# Altium project 17WAN.PrjPCB
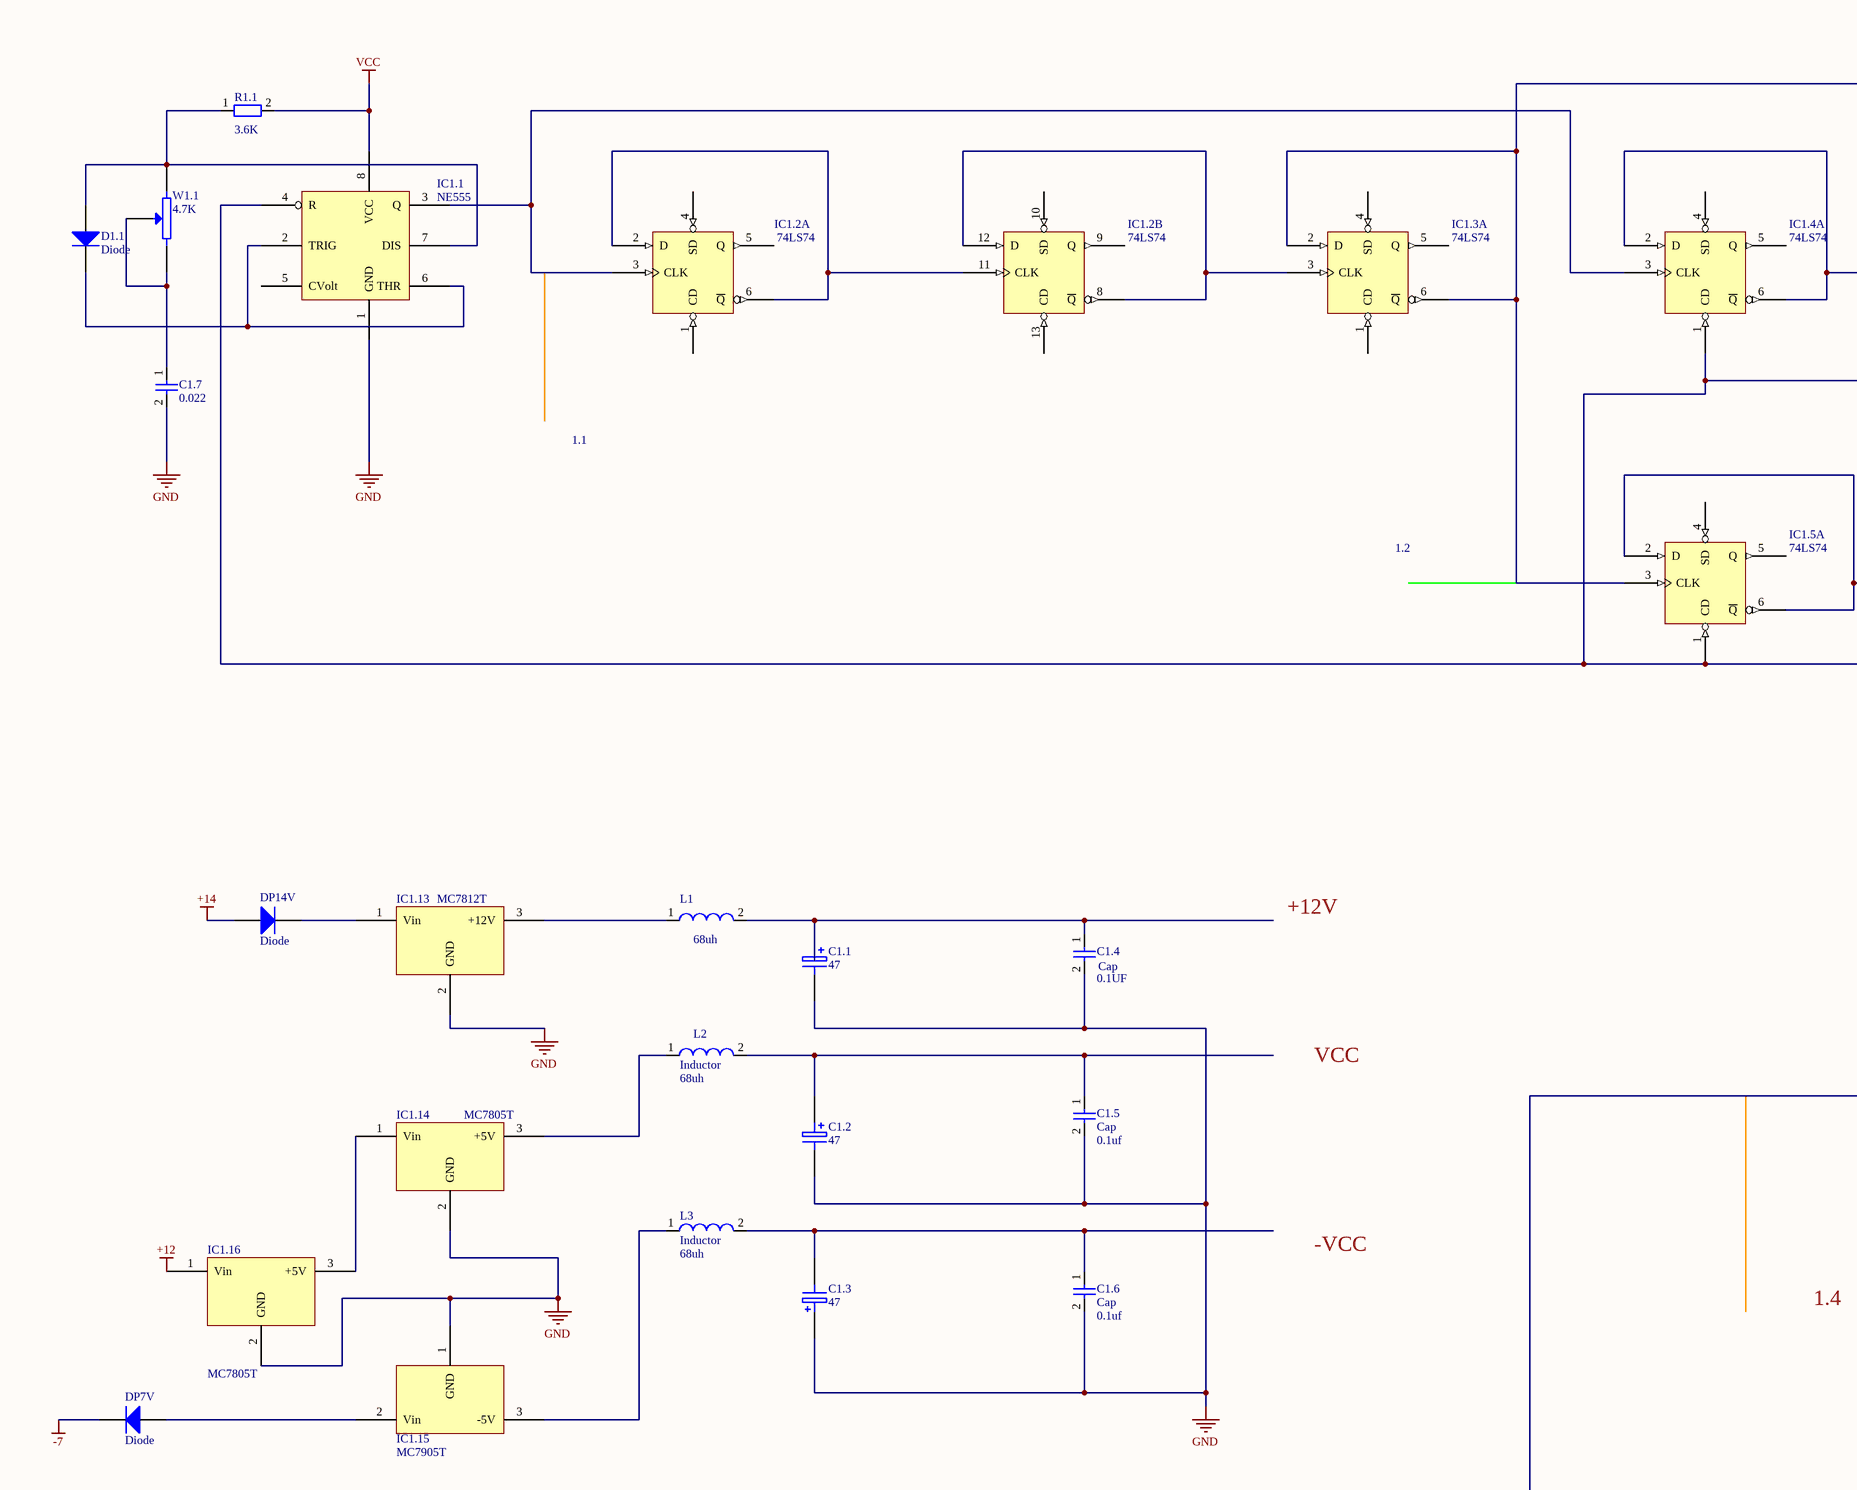
[diagram p0: 1.SchDoc, top left]
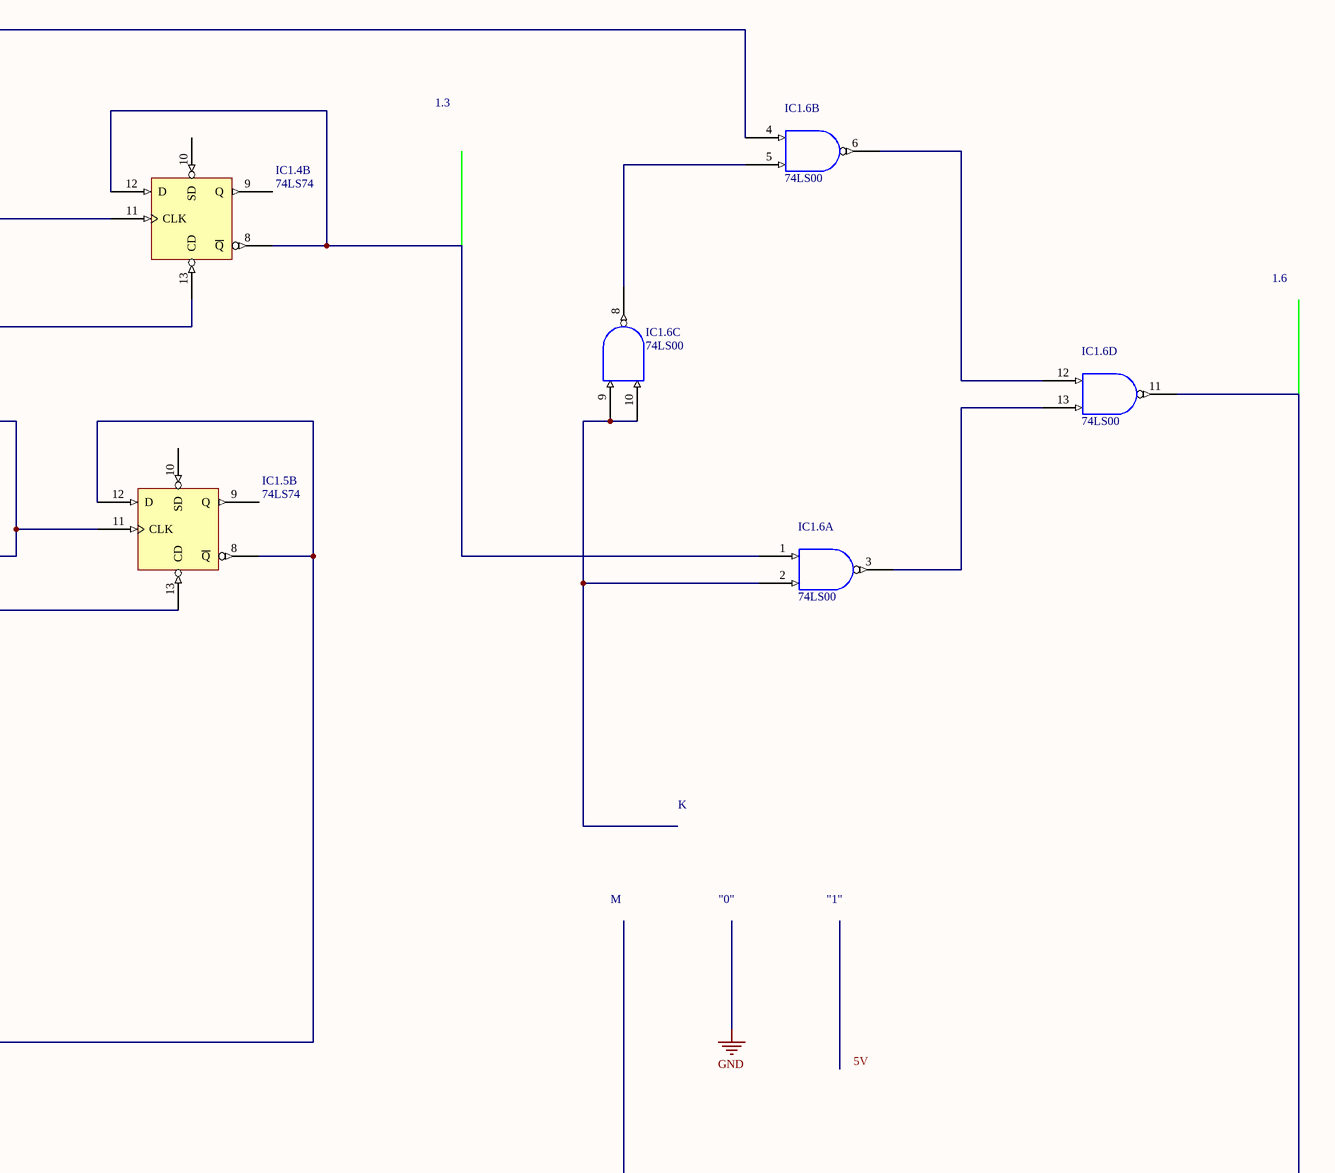
[diagram p1: 1.SchDoc, top right]
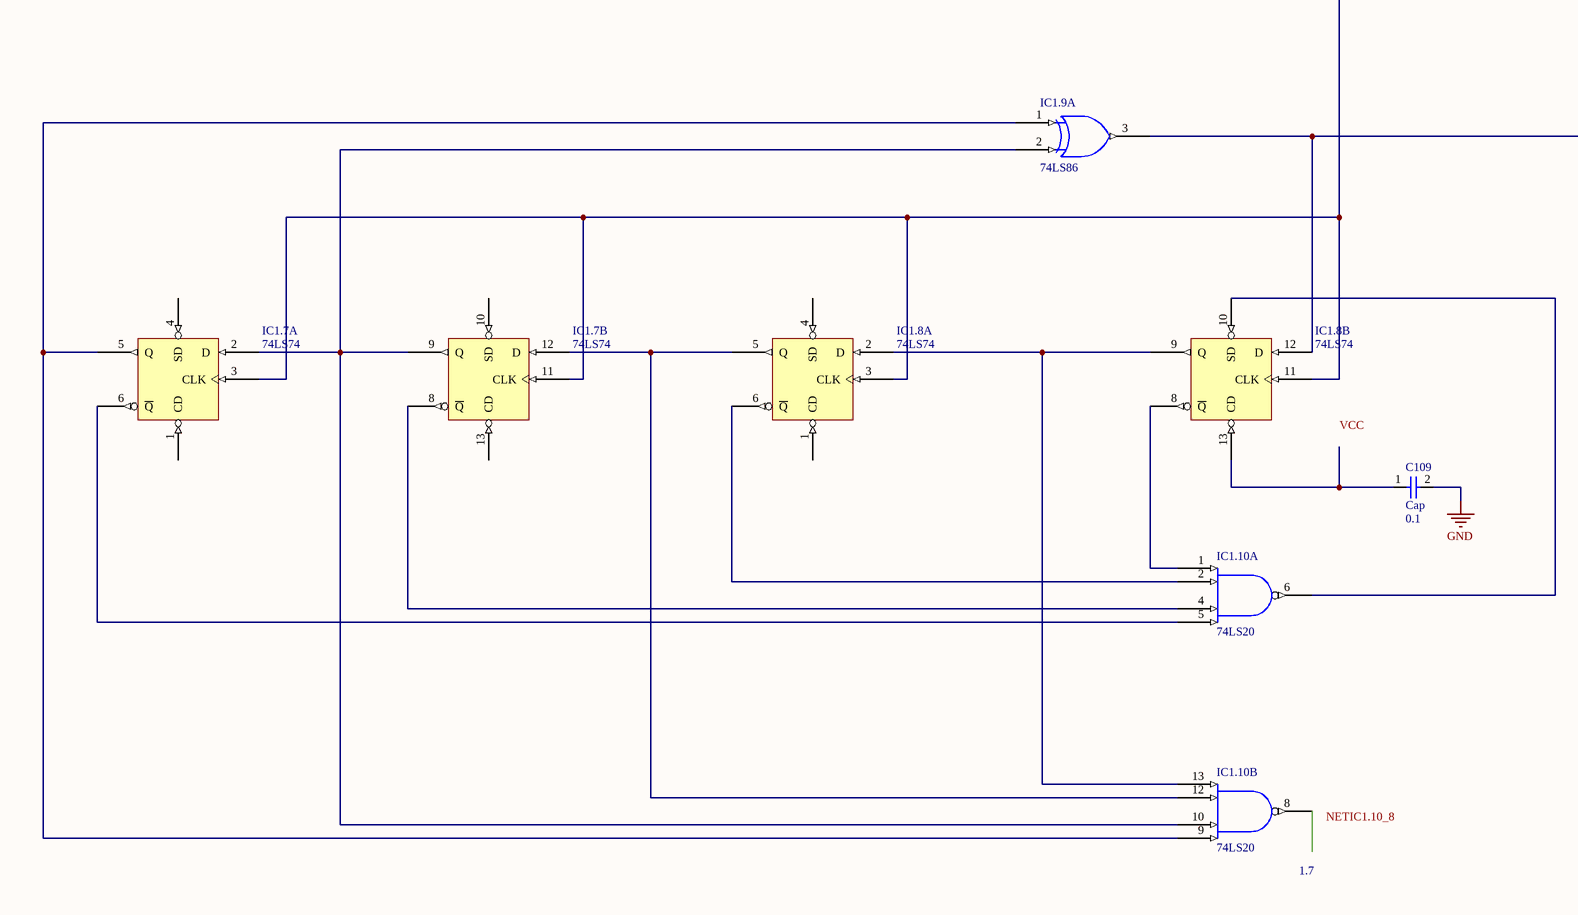
[diagram p2: 1.SchDoc, bottom left]
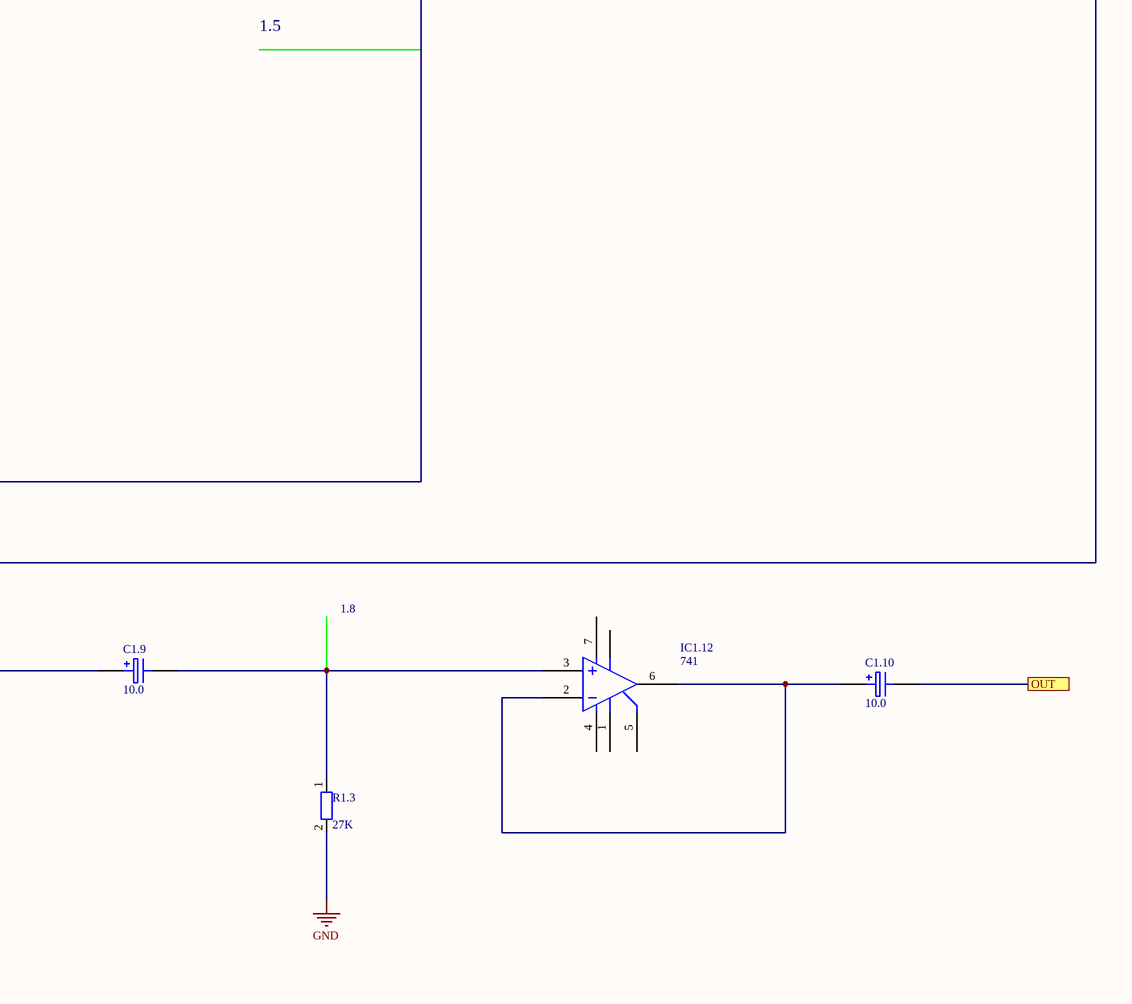
[diagram p3: 1.SchDoc, bottom right]
1 sheet, 34 parts. Net scope: flat (ports and power ports of the same name join across sheets).
Board file: 1520 - 副本 (2).PcbDoc

## Sheet 1.SchDoc
size D

### Parts
C1.1  47  [RAD-0.1]
C1.2  47  [RAD-0.1]
C1.3  47  [RAD-0.1]
C1.4  Cap  value 0.1UF  [RAD-0.3]
C1.5  Cap  value 0.1uf  [RAD-0.3]
C1.6  Cap  value 0.1uf  [RAD-0.3]
C1.7  value 0.022  [RAD-0.3]  (hidden comment: Cap)
C1.9  10.0  [RAD-0.1]
C1.10  10.0  [RAD-0.1]
C109  Cap  value 0.1  [RAD-0.3]
D1.1  Diode  [SMC]
DP7V  Diode  [SMC]
DP14V  Diode  [SMC]
IC1.1  NE555  [DIP-8]
IC1.2  74LS74  [DIP-14]  (parts A,B of 2)
IC1.3  74LS74  [DIP-14]  (part A of 2)
IC1.4  74LS74  [DIP-14]  (parts A,B of 2)
IC1.5  74LS74  [DIP-14]  (parts A,B of 2)
IC1.6  74LS00  [DIP-14]  (parts A,B,C,D of 4)
IC1.7  74LS74  [DIP-14]  (parts A,B of 2)
IC1.8  74LS74  [DIP-14]  (parts A,B of 2)
IC1.9  74LS86  [DIP-14]  (part A of 4)
IC1.10  74LS20  [DIP-14]  (parts A,B of 2)
IC1.12  741  [DIP-8]
IC1.13  MC7812T  [TO-220-AB]
IC1.14  MC7805T  [TO-220-AB]
IC1.15  MC7905T  [TO-220-AB]
IC1.16  MC7805T  [TO-220-AB]
L1  value 68uh  [0402-A]  (hidden comment: Inductor)
L2  Inductor  value 68uh  [0402-A]
L3  Inductor  value 68uh  [0402-A]
R1.1  value 3.6K  [AXIAL-0.4]  (hidden comment: Res2)
R1.3  value 27K  [AXIAL-0.4]
W1.1  4.7K  [VR3]

### Ports
OUT

### Nets
+12: IC1.16.1(Vin)
+14: DP14V.1(A)
-7: DP7V.2(K)
GND: C1.1.2 C1.2.2 C1.3.1 C1.4.2 C1.5.2 C1.6.2 C1.7.2 C109.2 IC1.1.1(GND) IC1.2.7(GND) IC1.3.7(GND) IC1.4.7(GND) IC1.5.7(GND) IC1.6.7(GND) IC1.7.7(GND) IC1.8.7(GND) IC1.9.7(GND) IC1.10.7(GND) IC1.13.2(GND) IC1.14.2(GND) IC1.15.1(GND) IC1.16.2(GND) R1.3.2
VCC: IC1.1.8(VCC) IC1.2.14(VCC) IC1.3.14(VCC) IC1.4.14(VCC) IC1.5.14(VCC) IC1.6.14(VCC) IC1.7.14(VCC) IC1.8.14(VCC) IC1.9.14(VCC) IC1.10.14(VCC) R1.1.2
NetC1.1_1: C1.1.1 C1.4.1 L1.2
NetC1.2_1: C1.2.1 C1.5.1 L2.2
NetC1.3_2: C1.3.2 C1.6.1 L3.2
NetC1.7_1: C1.7.1 W1.1.1 W1.1.3(W)
NetC1.9_1: C1.9.1 IC1.6.11
NetC1.9_2: C1.9.2 IC1.12.3 R1.3.1
NetC1.10_1: C1.10.1 IC1.12.2 IC1.12.6
NetC1.10_2: C1.10.2 ; port OUT
NetC109_1: C109.1 IC1.8.13(CD)
NetD1.1_1: D1.1.1(A) IC1.1.7(DIS) R1.1.1 W1.1.2
NetD1.1_2: D1.1.2(K) IC1.1.2(TRIG) IC1.1.6(THR)
NetDP7V_1: DP7V.1(A) IC1.15.2(Vin)
NetDP14V_2: DP14V.2(K) IC1.13.1(Vin)
NetIC1.1_3: IC1.1.3(Q) IC1.2.3(CLK) IC1.4.3(CLK)
NetIC1.1_4: IC1.1.4(R) IC1.4.1(CD) IC1.4.13(CD) IC1.5.1(CD) IC1.5.13(CD)
NetIC1.2_2: IC1.2.2(D) IC1.2.6(~{Q}) IC1.2.11(CLK)
NetIC1.2_8: IC1.2.8(~{Q}) IC1.2.12(D) IC1.3.3(CLK)
NetIC1.3_2: IC1.3.2(D) IC1.3.6(~{Q}) IC1.5.3(CLK) IC1.6.4
NetIC1.4_2: IC1.4.2(D) IC1.4.6(~{Q}) IC1.4.11(CLK)
NetIC1.4_8: IC1.4.8(~{Q}) IC1.4.12(D) IC1.6.1
NetIC1.5_2: IC1.5.2(D) IC1.5.6(~{Q}) IC1.5.11(CLK)
NetIC1.5_8: IC1.5.8(~{Q}) IC1.5.12(D) IC1.7.3(CLK) IC1.7.11(CLK) IC1.8.3(CLK) IC1.8.11(CLK)
NetIC1.6_2: IC1.6.2 IC1.6.9 IC1.6.10
NetIC1.6_3: IC1.6.3 IC1.6.13
NetIC1.6_5: IC1.6.5 IC1.6.8
NetIC1.6_6: IC1.6.6 IC1.6.12
NetIC1.7_2: IC1.7.2(D) IC1.7.9(Q) IC1.9.2 IC1.10.10
NetIC1.7_5: IC1.7.5(Q) IC1.9.1 IC1.10.9
NetIC1.7_6: IC1.7.6(~{Q}) IC1.10.5
NetIC1.7_8: IC1.7.8(~{Q}) IC1.10.4
NetIC1.7_12: IC1.7.12(D) IC1.8.5(Q) IC1.10.12
NetIC1.8_2: IC1.8.2(D) IC1.8.9(Q) IC1.10.13
NetIC1.8_6: IC1.8.6(~{Q}) IC1.10.2
NetIC1.8_8: IC1.8.8(~{Q}) IC1.10.1
NetIC1.8_10: IC1.8.10(SD) IC1.10.6
NetIC1.8_12: IC1.8.12(D) IC1.9.3
NetIC1.13_3: IC1.13.3(+12V) L1.1
NetIC1.14_1: IC1.14.1(Vin) IC1.16.3(+5V)
NetIC1.14_3: IC1.14.3(+5V) L2.1
NetIC1.15_3: IC1.15.3(-5V) L3.1

Not connected (* = marked no-connect by the designer): IC1.1 5(CVolt); IC1.2 1(CD) 4(SD) 5(Q) 9(Q) 10(SD) 13(CD); IC1.3 1(CD) 4(SD) 5(Q); IC1.4 4(SD) 5(Q) 9(Q) 10(SD); IC1.5 4(SD) 5(Q) 9(Q) 10(SD); IC1.7 1(CD) 4(SD) 10(SD) 13(CD); IC1.8 1(CD) 4(SD); IC1.10 8; IC1.12 1 4 5 7

### Notes on the sheet
- 1.3
- 1.6
- 1.1
- 1.2
- K
- +12V
- M
- "0"
- "1"
- VCC
- 5V
- -VCC
- 1.5
- 1.4
- 1.8
- NETIC1.10_8
- (near IC1.10) 1.7

### Library data of the parts
C1.1-C1.3 C1.9 C1.10 = ELECTRO1: Electrolytic Capacitor
C1.4-C1.7 C109 = Cap: Capacitor; Published: 8-Jun-2000; LatestRevisionDate: 17-Jul-2002; LatestRevisionNote: Re-released for DXP Platform.; PackageReference: RAD-0.3; Publisher: Altium Limited; PackageDescription: Radial Cap, Thru-Hole; 2 Leads; 0.3 in Pin Spacing
D1.1 DP7V DP14V = Diode: Default Diode; Published: 8-Jun-2000; LatestRevisionDate: 17-Jul-2002; LatestRevisionNote: Re-released for DXP Platform.; PackageVersion: Sep-1996; PackageReference: SMC; Publisher: Altium Limited; PackageDescription: DO-214-AB/SMC; 2 C-Bend Leads; Body 7.9 x 5.9 mm, inc. leads (LxW); Code_JEDEC: DO-214-AB
IC1.1 = 555
L1-L3 = Inductor: Code_IEC: 1005; Published: 8-Jun-2000; LatestRevisionDate: 29-May-2009; LatestRevisionNote: IPC-7351 Footprint Added.; PackageReference: 0402-A; Publisher: Altium Limited; PackageDescription: Chip Inductor; Code_JEITA: 0402
R1.1 R1.3 = Res2: Resistor; Published: 8-Jun-2000; LatestRevisionDate: 17-Jul-2002; LatestRevisionNote: Re-released for DXP Platform.; PackageReference: AXIAL-0.4; Publisher: Altium Limited; PackageDescription: Axial Device, Thru-Hole; 2 Leads; 0.4 in Pin Spacing
W1.1 = POT2: Potentiometer